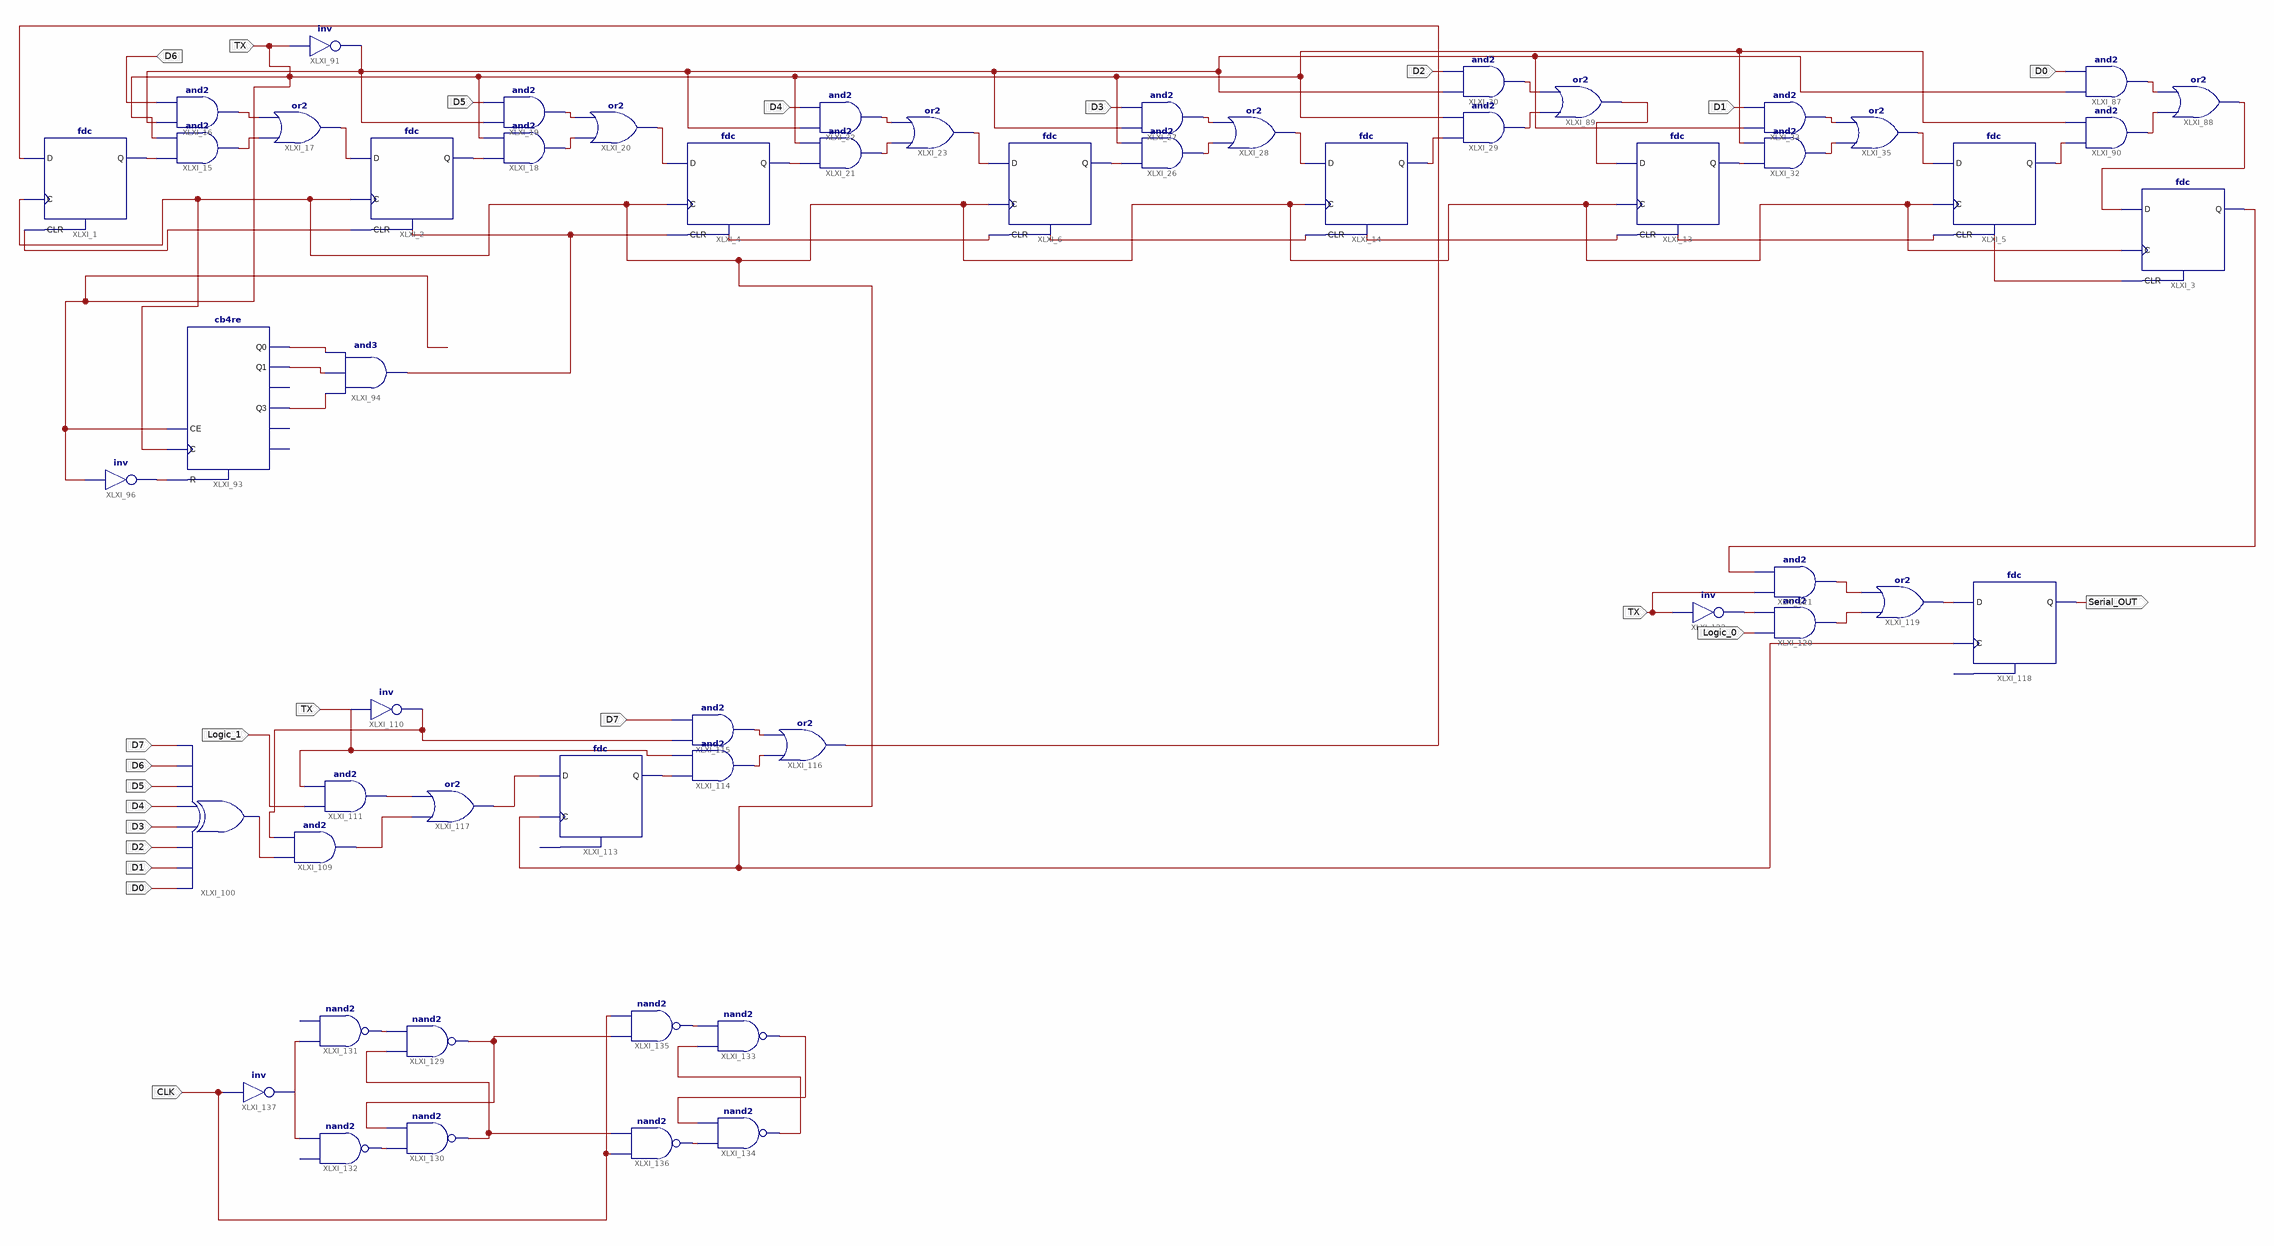
[diagram p0: schematic sheet 1]
// Xilinx ISE schematic TX.sch (spartan6) as structural Verilog: 56 symbols, 13 ports
module TX (
  input  D6,
  input  D5,
  input  D4,
  input  D3,
  input  D2,
  input  D1,
  input  D0,
  input  TX,
  input  D7,
  input  Logic_1,
  input  Logic_0,
  input  CLK,
  output Serial_OUT
);

  wire XLXN_1, XLXN_2, XLXN_3, XLXN_5, XLXN_8, XLXN_9, XLXN_10, XLXN_11, XLXN_15, XLXN_16, XLXN_17, XLXN_19,
       XLXN_23, XLXN_24, XLXN_25, XLXN_26, XLXN_32, XLXN_35, XLXN_36, XLXN_37, XLXN_40, XLXN_105, XLXN_106,
       XLXN_107, XLXN_112, XLXN_114, XLXN_115, XLXN_116, XLXN_117, XLXN_127, XLXN_130, XLXN_131, XLXN_132,
       XLXN_134, XLXN_138, XLXN_140, XLXN_141, XLXN_142, XLXN_143, XLXN_145, XLXN_148, XLXN_195, XLXN_198,
       XLXN_200, XLXN_201, XLXN_220, XLXN_224, XLXN_225, XLXN_226, XLXN_228, XLXN_229, XLXN_230, XLXN_231,
       XLXN_238, XLXN_244, XLXN_255, XLXN_256, XLXN_257, XLXN_260, XLXN_261, XLXN_262, XLXN_263, XLXN_264,
       XLXN_265;

  fdc XLXI_3 (.C(XLXN_244), .CLR(XLXN_145), .D(XLXN_116), .Q(XLXN_238));
  fdc XLXI_1 (.C(XLXN_244), .CLR(XLXN_138), .D(XLXN_148), .Q(XLXN_1));
  and XLXI_15 (XLXN_3, XLXN_1, TX);
  and XLXI_16 (XLXN_2, XLXN_117, D6);
  or XLXI_17 (XLXN_5, XLXN_3, XLXN_2);
  fdc XLXI_2 (.C(XLXN_244), .CLR(XLXN_138), .D(XLXN_5), .Q(XLXN_8));
  and XLXI_18 (XLXN_10, XLXN_8, TX);
  and XLXI_19 (XLXN_9, XLXN_117, D5);
  or XLXI_20 (XLXN_11, XLXN_10, XLXN_9);
  fdc XLXI_4 (.C(XLXN_244), .CLR(XLXN_132), .D(XLXN_11), .Q(XLXN_15));
  and XLXI_21 (XLXN_17, XLXN_15, TX);
  and XLXI_22 (XLXN_16, XLXN_117, D4);
  or XLXI_23 (XLXN_19, XLXN_17, XLXN_16);
  fdc XLXI_6 (.C(XLXN_244), .CLR(XLXN_140), .D(XLXN_19), .Q(XLXN_25));
  and XLXI_26 (XLXN_24, XLXN_25, TX);
  and XLXI_27 (XLXN_23, XLXN_117, D3);
  or XLXI_28 (XLXN_26, XLXN_24, XLXN_23);
  fdc XLXI_14 (.C(XLXN_244), .CLR(XLXN_141), .D(XLXN_26), .Q(XLXN_32));
  and XLXI_29 (XLXN_106, XLXN_32, TX);
  and XLXI_30 (XLXN_105, XLXN_117, D2);
  fdc XLXI_13 (.C(XLXN_244), .CLR(XLXN_142), .D(XLXN_107), .Q(XLXN_37));
  and XLXI_32 (XLXN_36, XLXN_37, TX);
  and XLXI_33 (XLXN_35, XLXN_117, D1);
  or XLXI_35 (XLXN_40, XLXN_36, XLXN_35);
  fdc XLXI_5 (.C(XLXN_244), .CLR(XLXN_143), .D(XLXN_40), .Q(XLXN_112));
  and XLXI_87 (XLXN_114, XLXN_117, D0);
  or XLXI_89 (XLXN_107, XLXN_106, XLXN_105);
  and XLXI_90 (XLXN_115, XLXN_112, TX);
  or XLXI_88 (XLXN_116, XLXN_115, XLXN_114);
  not XLXI_91 (XLXN_117, TX);
  xor XLXI_100 (XLXN_220, D0, D1, D2, D3, D4, D5, D6, D7);
  and XLXI_109 (XLXN_225, XLXN_220, XLXN_195);
  not XLXI_110 (XLXN_195, TX);
  and XLXI_111 (XLXN_224, Logic_1, TX);
  fdc XLXI_113 (.C(XLXN_244), .D(XLXN_226), .Q(XLXN_198));  // open: CLR
  and XLXI_114 (XLXN_201, XLXN_198, TX);
  and XLXI_115 (XLXN_200, XLXN_195, D7);
  or XLXI_116 (XLXN_148, XLXN_201, XLXN_200);
  or XLXI_117 (XLXN_226, XLXN_225, XLXN_224);
  fdc XLXI_118 (.C(XLXN_244), .D(XLXN_228), .Q(Serial_OUT));  // open: CLR
  or XLXI_119 (XLXN_228, XLXN_230, XLXN_229);
  and XLXI_120 (XLXN_230, Logic_0, XLXN_231);
  and XLXI_121 (XLXN_229, TX, XLXN_238);
  not XLXI_122 (XLXN_231, TX);
  nand XLXI_129 (XLXN_264, XLXN_255, XLXN_257);
  nand XLXI_130 (XLXN_255, XLXN_256, XLXN_264);
  not XLXI_131 (XLXN_257, XLXN_265);  // nand2 open: I1
  not XLXI_132 (XLXN_256, XLXN_265);  // nand2 open: I0
  nand XLXI_133 (XLXN_260, XLXN_261, XLXN_263);
  nand XLXI_134 (XLXN_261, XLXN_262, XLXN_260);
  nand XLXI_135 (XLXN_263, XLXN_264, CLK);
  nand XLXI_136 (XLXN_262, CLK, XLXN_255);
  not XLXI_137 (XLXN_265, CLK);
  and XLXI_94 (XLXN_132, XLXN_127, XLXN_131, XLXN_130);
  not XLXI_96 (XLXN_134, TX);
  cb4re XLXI_93 (
    .C(XLXN_244), .CE(TX), .R(XLXN_134), .Q0(XLXN_130), .Q1(XLXN_131), .Q3(XLXN_127));  // open: CEO, Q2, TC
endmodule
